# Altium schematic sheet Top.SchDoc
size B; Author: E. Sims; Organization: Let's Build Rockets Inc.; SheetNumber: 1; SheetTotal: 4
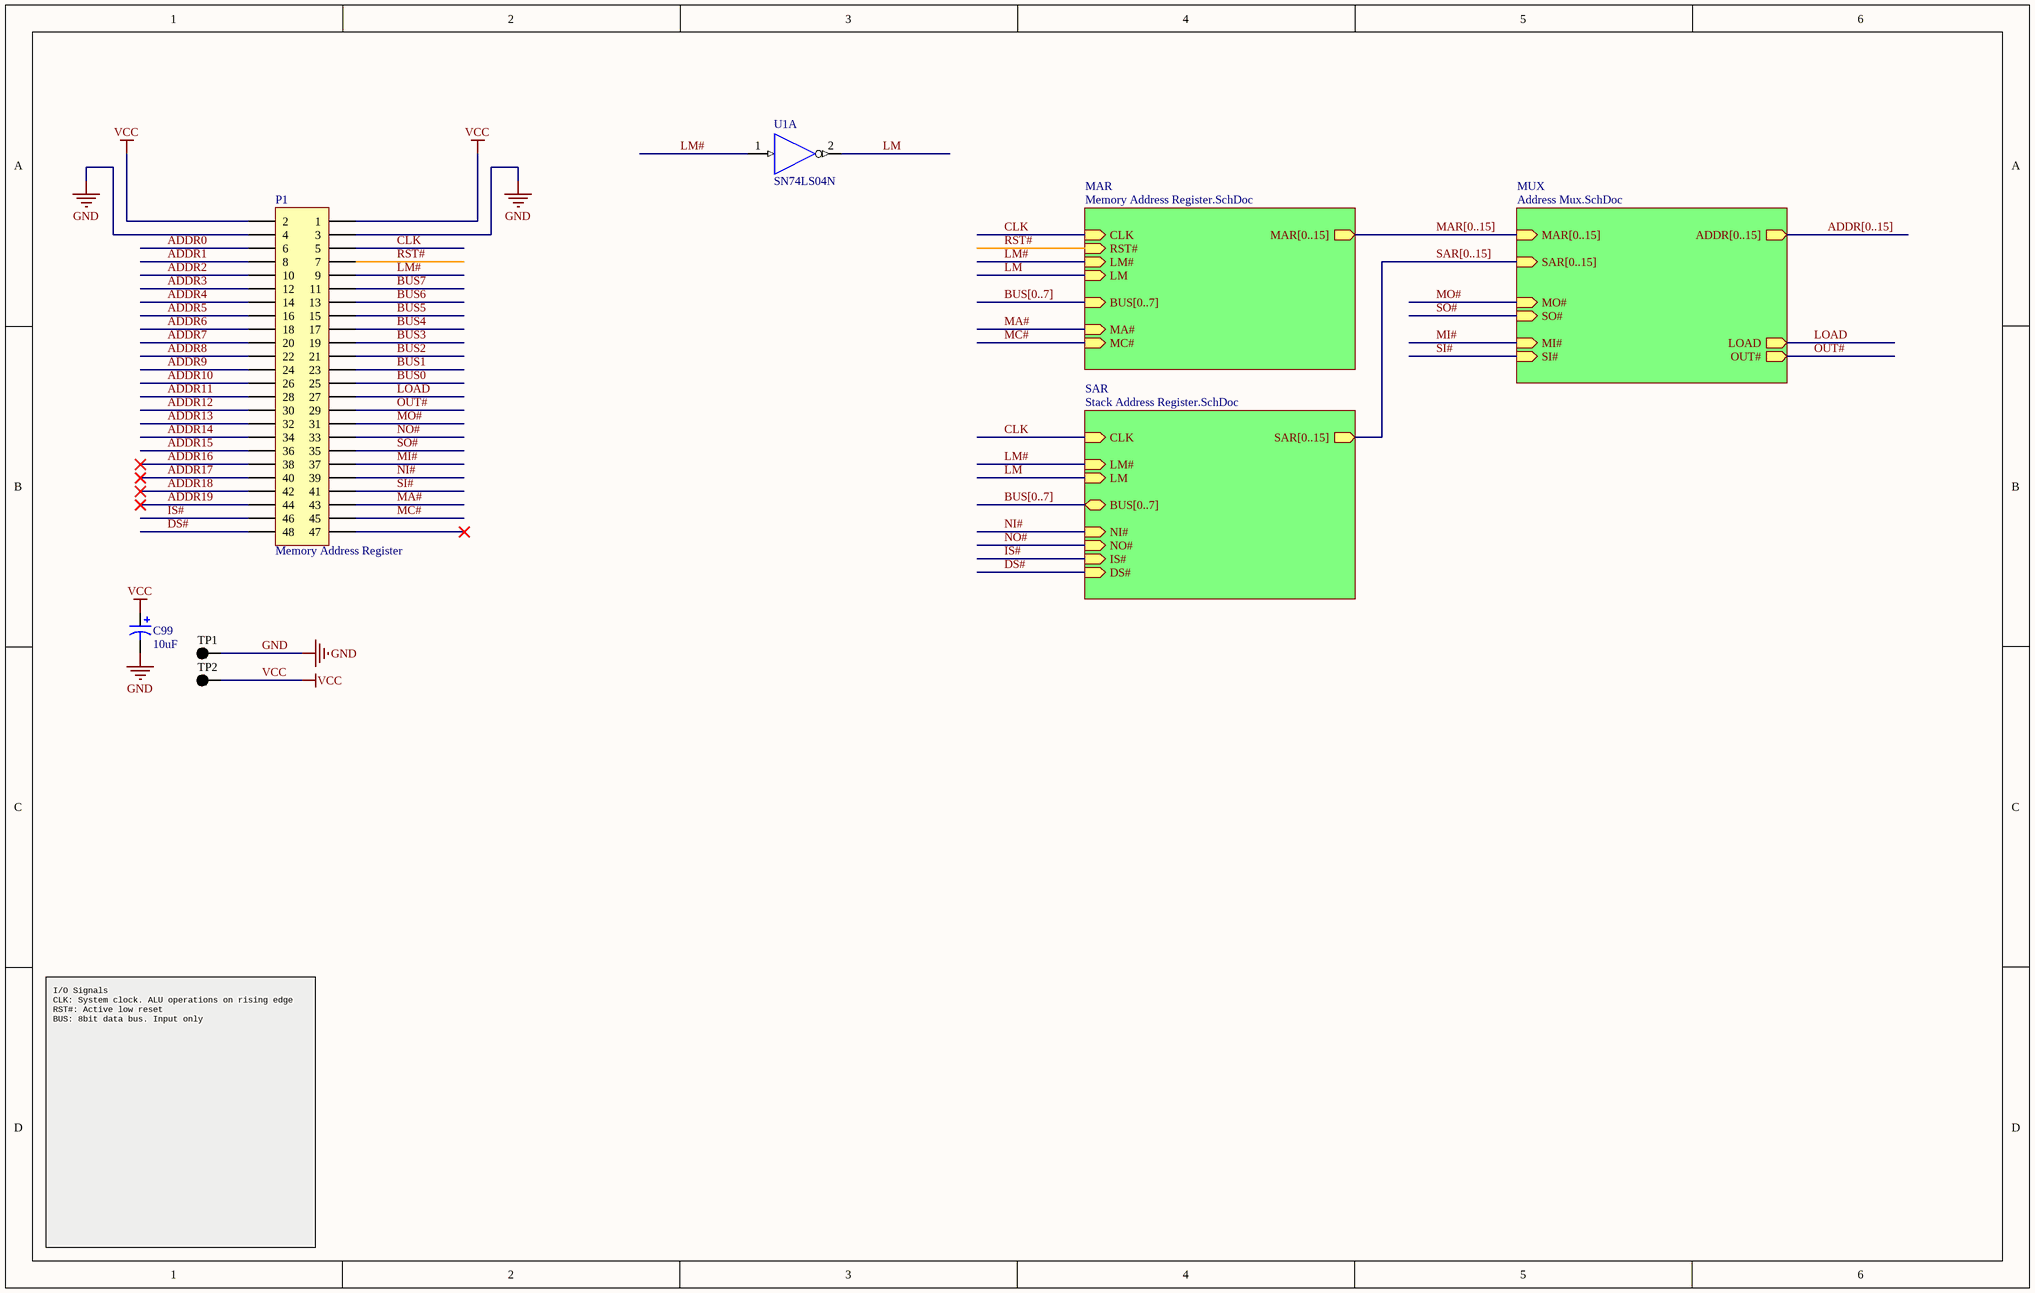
[diagram p0: Top.SchDoc]

## Parts
C99  value 10uF  [C5x7]  (hidden comment: Cap Pol5)
P1  Memory Address Register  [HDR2X24H]
TP1  (no value)  [KSTN-5011_V]
TP2  (no value)  [KSTN-5011_V]
U1  SN74LS04N  [N014]  (part A of 6)

## Sub-sheets
MAR = Memory Address Register.SchDoc: CLK (in), MA# (in), LM# (in), MAR[0..15] (out), RST# (in), BUS[0..7] (in), MC# (in), LM (in)
MUX = Address Mux.SchDoc: MAR[0..15] (in), SAR[0..15] (in), ADDR[0..15] (out), LOAD (out), OUT# (out), MO# (in), SO# (in), MI# (in), SI# (in)
SAR = Stack Address Register.SchDoc: CLK (in), IS# (in), SAR[0..15] (out), DS# (in), NI# (in), BUS[0..7] (bidir), LM# (in), NO# (in), LM (in)

## Nets
GND: C99.2 P1.3 P1.4 TP1.1 U1.7(GND)
VCC: C99.1 P1.1 P1.2 TP2.1 U1.14(VCC)
ADDR0: P1.6
ADDR1: P1.8
ADDR2: P1.10
ADDR3: P1.12
ADDR4: P1.14
ADDR5: P1.16
ADDR6: P1.18
ADDR7: P1.20
ADDR8: P1.22
ADDR9: P1.24
ADDR10: P1.26
ADDR11: P1.28
ADDR12: P1.30
ADDR13: P1.32
ADDR14: P1.34
ADDR15: P1.36
ADDR16: P1.38
ADDR17: P1.40
ADDR18: P1.42
ADDR19: P1.44
BUS0: P1.25
BUS1: P1.23
BUS2: P1.21
BUS3: P1.19
BUS4: P1.17
BUS5: P1.15
BUS6: P1.13
BUS7: P1.11
CLK: P1.5 ; sheet MAR/CLK, sheet SAR/CLK
DS#: P1.48 ; sheet SAR/DS#
IS#: P1.46 ; sheet SAR/IS#
LM: U1.2(Y) ; sheet MAR/LM, sheet SAR/LM
LM#: P1.9 U1.1(A) ; sheet MAR/LM#, sheet SAR/LM#
LOAD: P1.27 ; sheet MUX/LOAD
MA#: P1.43 ; sheet MAR/MA#
MC#: P1.45 ; sheet MAR/MC#
MI#: P1.37 ; sheet MUX/MI#
MO#: P1.31 ; sheet MUX/MO#
NI#: P1.39 ; sheet SAR/NI#
NO#: P1.33 ; sheet SAR/NO#
OUT#: P1.29 ; sheet MUX/OUT#
RST#: P1.7 ; sheet MAR/RST#
SI#: P1.41 ; sheet MUX/SI#
SO#: P1.35 ; sheet MUX/SO#

Not connected (* = marked no-connect by the designer): P1 47*

## Buses and harness runs
bus ADDR[0..15] = sheet MUX/ADDR[0..15]
bus BUS[0..7] = sheet MAR/BUS[0..7]
bus BUS[0..7] = sheet SAR/BUS[0..7]
bus MAR[0..15] = sheet MAR/MAR[0..15] = sheet MUX/MAR[0..15]
bus SAR[0..15] = sheet MUX/SAR[0..15] = sheet SAR/SAR[0..15]

## Notes on the sheet
- I/O Signals
  CLK: System clock. ALU operations on rising edge
  RST#: Active low reset
  BUS: 8bit data bus. Input only
- Let's Build Rocket's Inc. Modular Paylaod System Based on TMP-010 Rev
  For more information visit https://github.com/LetsBuildRockets/Modular-Payload-System
  This work is licensed under CC BY-NC 4.0. To view a copy of this license, visit https://creativecommons.org/licenses/by-nc/4.0
- Title
- Size:
- Date:
- Assembly Variant:
- B
- Number:
- Time:
- Revision:
- Sheet
- of
- Author:
- File:

## Library data of the parts
C99 = Cap Pol5: Polarized Capacitor; Published: 8-Jun-2000; LatestRevisionDate: 17-Jul-2002; LatestRevisionNote: Re-released for DXP Platform.; PackageReference: POLAR0.8; Publisher: Altium Limited; PackageDescription: Polarized Capacitor; 2 Leads
P1 = Header 24x2H: Header, 24-Pin, Dual row, Right Angle; System: Connector; LatestRevisionDate: 17-Jul-2002; LatestRevisionNote: Re-released for DXP Platform.; Publisher: Altium Limited
TP1 TP2 = CMP-1672-00003-4: Test Point, Black, Through Hole, RoHS, Bulk; Manufacturer: Keystone; ComponentLink2URL: http://www.keyelco.com/product-pdf.cfm?p=1320; Colour: Black; Pins: 1; REACH SVHC: No SVHC; ComponentLink1URL: http://www.keyelco.com/; PackageReference: 5011; Contact Plating: Silver; Package Quantity: 100; Packaging: Bulk; RoHSCompliant: true; Height: 8.12 mm; PackageDescription: 1-Pin Through Hole Device, Dia 3.17 mm; Mount: Through Hole; Mounting Technology: Through Hole; DatasheetVersion: Rev. F, 12/2013; ComponentLink1Description: Manufacturer URL; Contact Material: Bronze; ComponentLink2Description: Datasheet
U1 = SN74LS04N: Hex Inverter; Published: 8-Jun-2000; LatestRevisionDate: 04-Mar-2005; LatestRevisionNote: Stylized 3D Model Added.; DatasheetVersion: Mar-1988; PackageVersion: Oct-1995; PackageReference: N014; Publisher: Altium Limited; PackageDescription: DIP; 14 Leads; Row Spacing 7.62 mm; Pitch 2.54 mm; ComponentLink1Description: Manufacturer Link; ComponentLink1URL: http://www.ti.com/; ComponentLink2Description: Datasheet; ComponentLink2URL: http://www-s.ti.com/sc/ds/sn74ls04.pdf